# EAGLE design V-00716-02 (EAGLE 7.2.0)
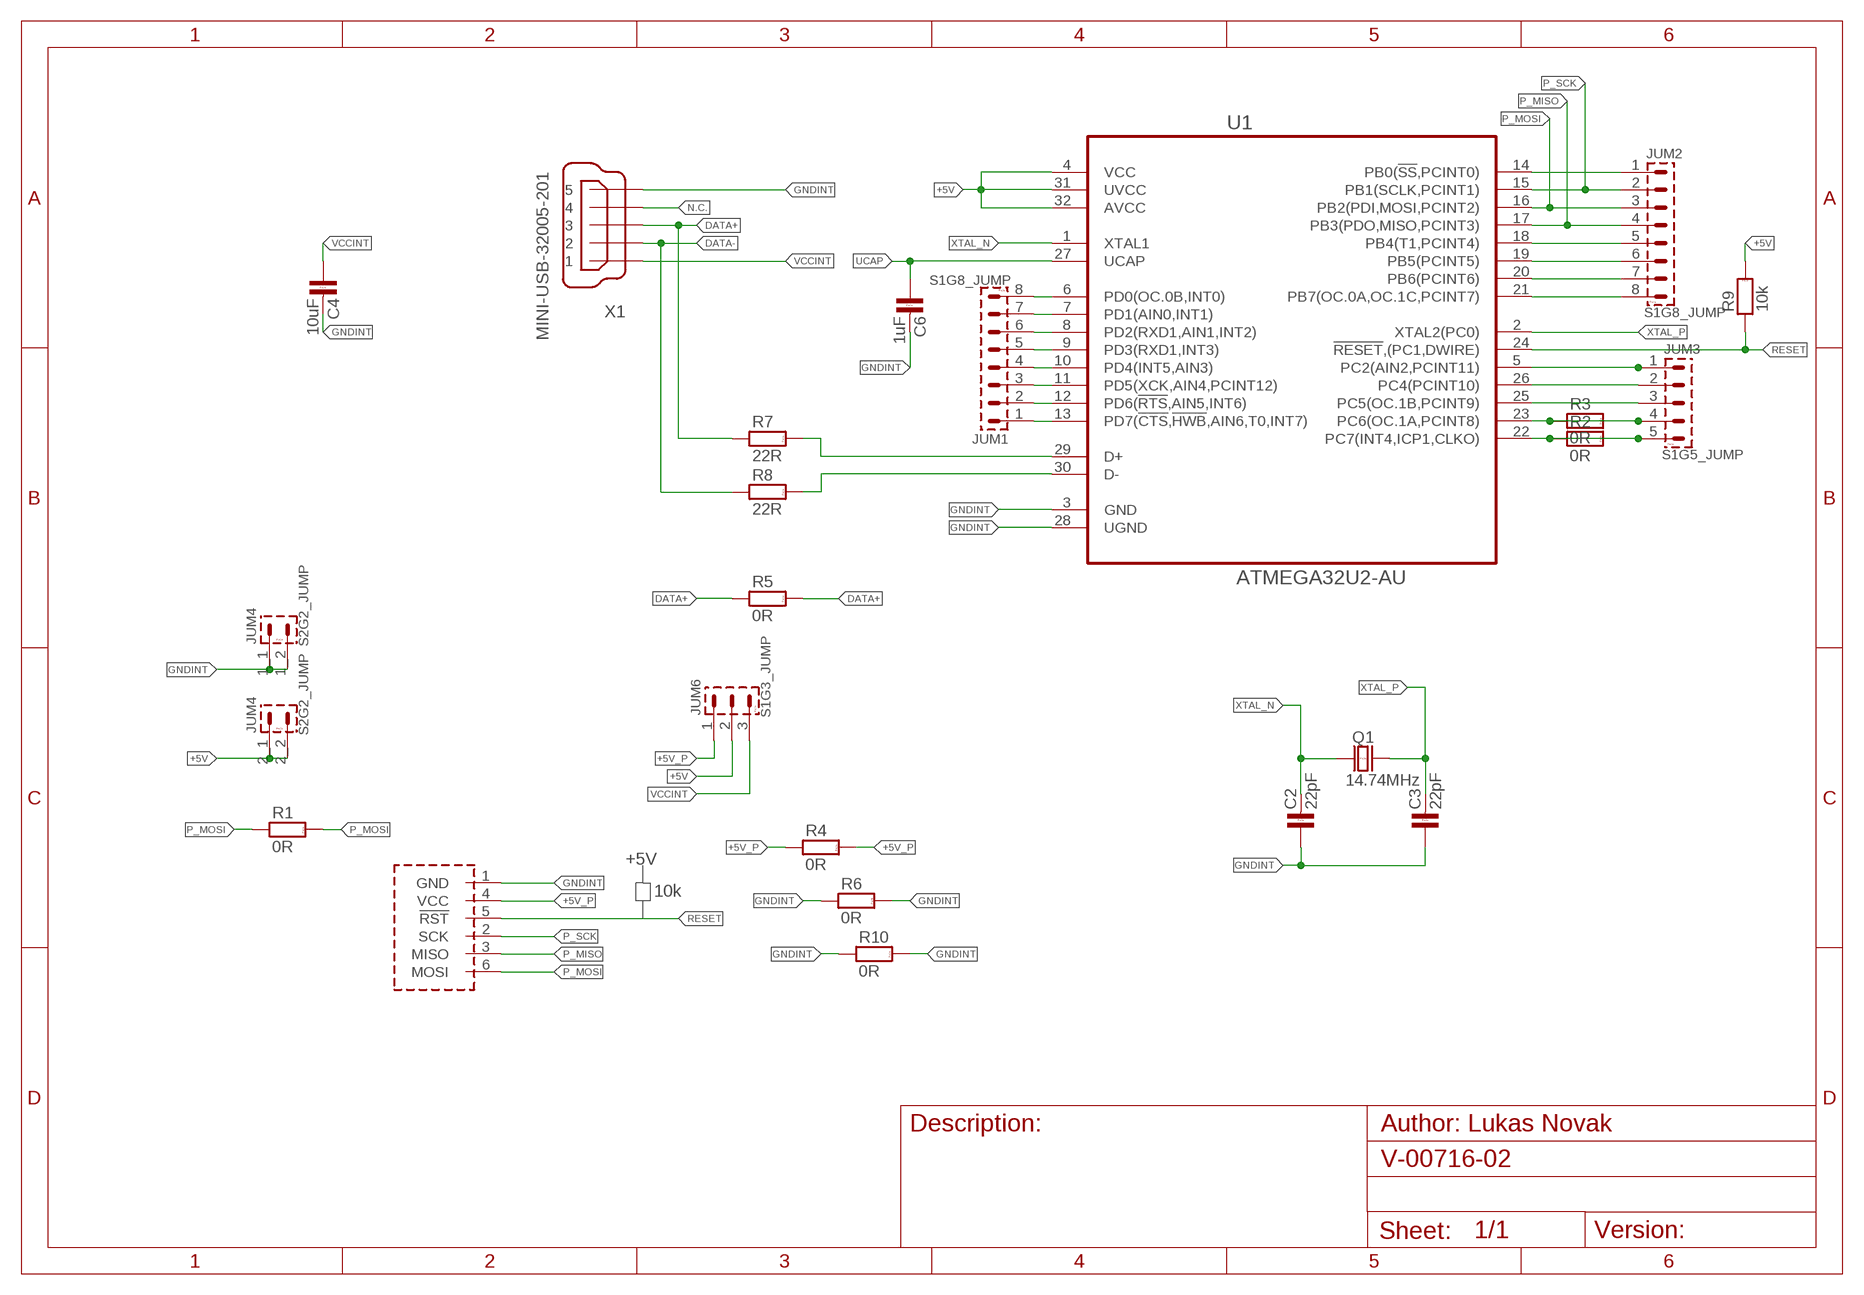
[diagram p0: schematic, sheet 1]

## Parts
C2  22pF  C-KER_0805  [0805]
C3  22pF  C-KER_0805  [0805]
C4  10uF  C-KER_1206  [1206]
C6  1uF  C-KER_1206  [1206]
JUM1  S1G8_JUMP  [S1G8_JUM]
JUM2  S1G8_JUMP  [S1G8_JUM]
JUM3  S1G5_JUMP  [S1G5_JUM]
JUM4  S2G2_JUMP  [S2G2_JUM]
JUM6  S1G3_JUMP  [S1G3_JUM]
Q1  14.74MHz  Q_HC-49U  [HC-49U]
R1  0R  R_1206  [1206]
R2  0R  R_1206  [1206]
R3  0R  R_1206  [1206]
R4  0R  R_1206  [1206]
R5  0R  R_1206  [1206]
R6  0R  R_1206  [1206]
R7  22R  R_1206  [1206]
R8  22R  R_1206  [1206]
R9  10k  R_1206  [1206]
R10  0R  R_1206  [1206]
U1  ATMEGA32U2-AU  [QFP80P900X900X120-32N]
U$1  AVR_PROG_SPI  [PSH02-06P]
X1  MINI-USB-32005-201  [32005-201]

## Nets
+5V: JUM4.2_1 JUM4.2_2 JUM6.2 R9.2 U1.4(VCC) U1.31(UVCC) U1.32(AVCC)
+5V_P: JUM6.1 R4.1 R4.2 U$1.4(VCC)
DATA+: R5.1 R5.2 R7.1 X1.3
DATA-: R8.1 X1.2
GNDINT: C2.1 C3.1 C4.2 C6.2 JUM4.1_1 JUM4.1_2 R6.1 R6.2 R10.1 R10.2 U1.3(GND) U1.28(UGND) U$1.1(GND) X1.5
N$1: JUM1.1 U1.13(PD7(!CTS,!HWB,AIN6,T0,INT7))
N$2: R7.2 U1.29(D+)
N$3: JUM1.2 U1.12(PD6(!RTS,AIN5,INT6))
N$4: JUM1.3 U1.11(PD5(XCK,AIN4,PCINT12))
N$5: JUM1.4 U1.10(PD4(INT5,AIN3))
N$6: JUM1.5 U1.9(PD3(RXD1,INT3))
N$7: JUM1.6 U1.8(PD2(RXD1,AIN1,INT2))
N$8: JUM1.7 U1.7(PD1(AIN0,INT1))
N$9: JUM1.8 U1.6(PD0(OC.0B,INT0))
N$10: JUM3.1 U1.5(PC2(AIN2,PCINT11))
N$11: JUM3.2 U1.26(PC4(PCINT10))
N$12: R8.2 U1.30(D-)
N$13: JUM3.3 U1.25(PC5(OC.1B,PCINT9))
N$14: JUM3.4 R3.1 R3.2 U1.23(PC6(OC.1A,PCINT8))
N$15: JUM3.5 R2.1 R2.2 U1.22(PC7(INT4,ICP1,CLKO))
N$16: JUM2.1 U1.14(PB0(!SS,PCINT0))
N$20: JUM2.5 U1.18(PB4(T1,PCINT4))
N$21: JUM2.6 U1.19(PB5(PCINT5))
N$22: JUM2.7 U1.20(PB6(PCINT6))
N$23: JUM2.8 U1.21(PB7(OC.0A,OC.1C,PCINT7))
N.C.: X1.4
P_MISO: JUM2.4 U1.17(PB3(PDO,MISO,PCINT3)) U$1.3(MISO)
P_MOSI: JUM2.3 R1.1 R1.2 U1.16(PB2(PDI,MOSI,PCINT2)) U$1.6(MOSI)
P_SCK: JUM2.2 U1.15(PB1(SCLK,PCINT1)) U$1.2(SCK)
RESET: R9.1 U1.24(!RESET,(PC1,DWIRE)) U$1.5(!RST)
UCAP: C6.1 U1.27(UCAP)
VCCINT: C4.1 JUM6.3 X1.1
XTAL_N: C2.2 Q1.1 U1.1(XTAL1)
XTAL_P: C3.2 Q1.2 U1.2(XTAL2(PC0))

## Notes on the sheet
- +5V
- 10k

## Library data of the parts
C2-C4 C6 = #PaJa_31:C-KER: Kondenzator - keramicky
JUM1 JUM2 = #PaJa_konektory:S1G8_JUMP: Radove konektory - koliky - 8x
JUM3 = #PaJa_konektory:S1G5_JUMP: Radove konektory - koliky - 5x
JUM4 = #PaJa_konektory:S2G2_JUMP: Radove konektory - koliky - dvojite - 2x2
JUM6 = #PaJa_konektory:S1G3_JUMP: Radove konektory - koliky - 3x
Q1 = #PaJa_31:Q: Krystal HC-49 - 1MHz - 48MHz DT38 - Quartz (hodinovy) 32,768kHz
R1-R10 = #PaJa_31:R: Rezistor
U1 = #_Atmel_By_element14_Batch_1-00:ATMEGA32U2-AU: 8-bit Microcontroller with ISP Flash and USB Controller; MPN: ATMEGA32U2-AU; OC_FARNELL: 1748524; OC_NEWARK: 26R5632; PACKAGE: TQFP-32; SUPPLIER: Atmel
U$1 = #PaJa_konektory:AVR_PROG_SPI
X1 = con-cypressindustries:MINI-USB-: MINI USB-B Conector Source: www.cypressindustries.com; OC_FARNELL: unknown; OC_NEWARK: unknown

## Net classes
0 default: width 0.406 mm, clearance 0.406 mm

## Board
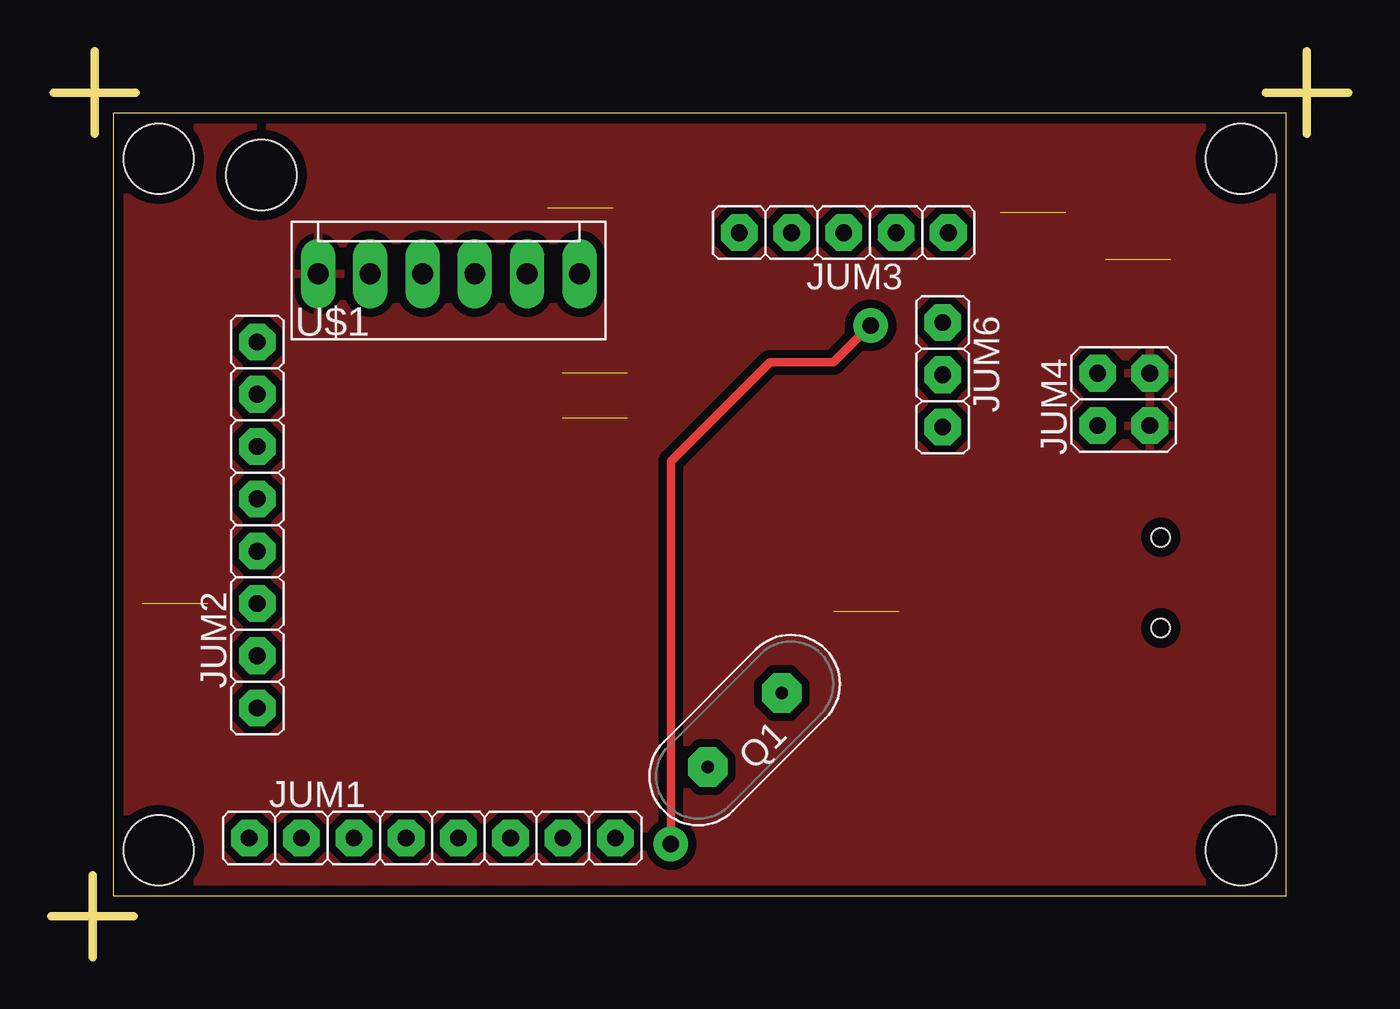
[diagram p1: board, top side]
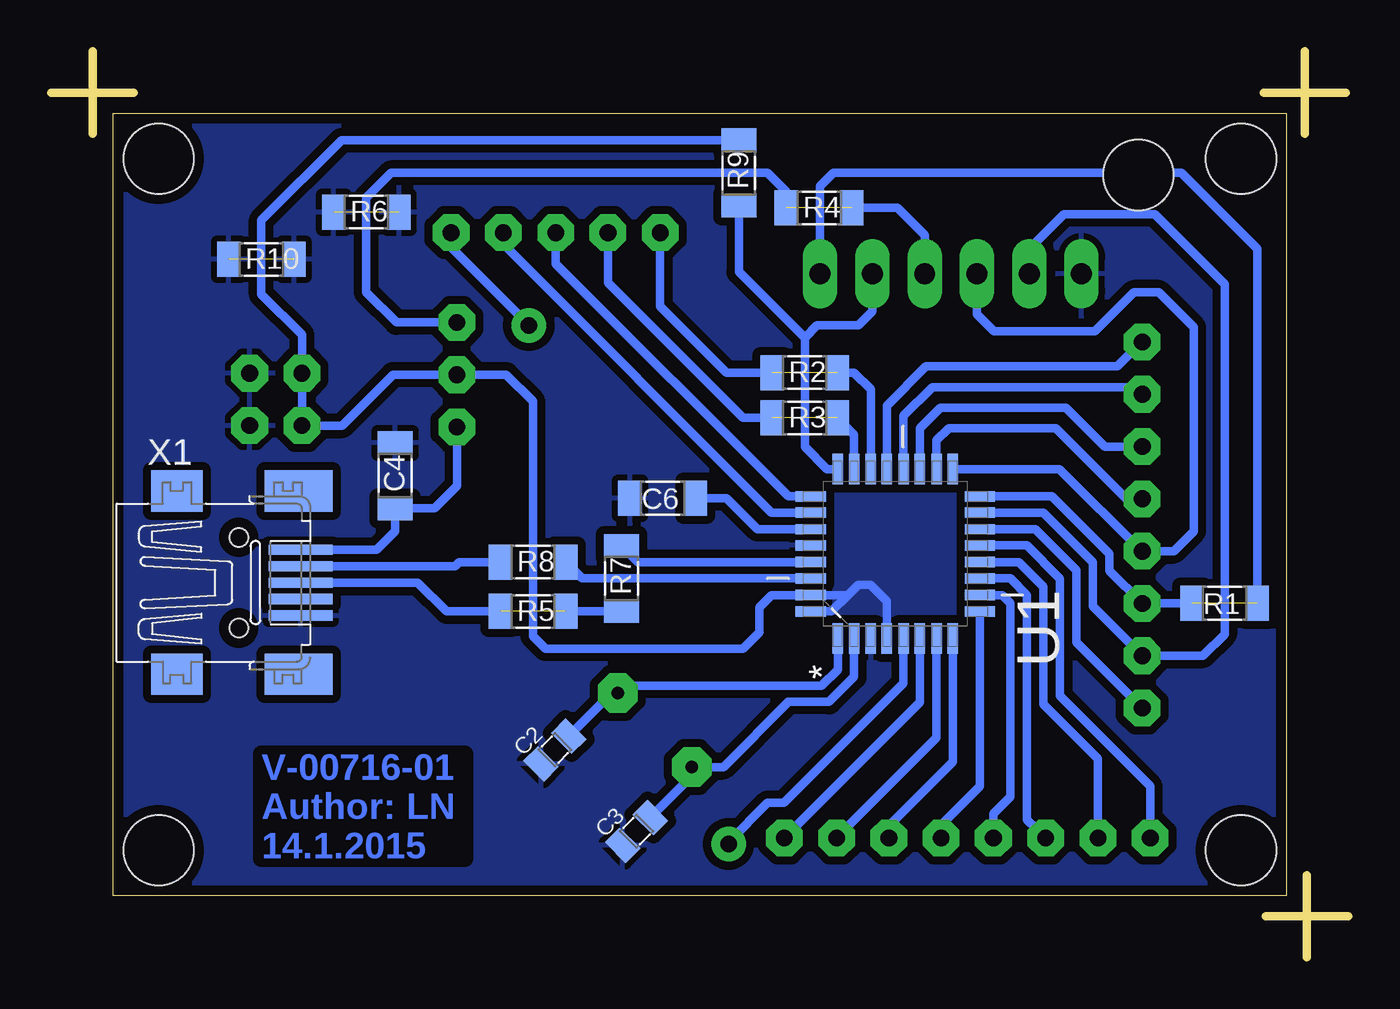
[diagram p2: board, bottom side, seen from below]

Size 63 x 44 mm. Coordinates in mm from the lower left corner, seen from the top.
Outline: 4,2 2,2
Outline: 2,2 0,2
Outline: 2,2 2,4
Outline: 2,2 2,0
Outline: 2.1,42 2.1,40
Outline: 2.1,42 4.1,42
Outline: 2.1,42 0.1,42
Outline: 2.1,42 2.1,44
Outline: 61,42 61,40
Outline: 61,42 59,42
Outline: 61,42 63,42
Outline: 61,42 61,44
Outline: 3,3 60,3 60,41 3,41 3,3
Copper layers (1*16): Top 0.035mm / dielectric 1.5mm / Bottom 0.035mm
Design rules "mucha_navrh *": minimum track width 0.2mm, minimum drill 0.3mm, track to track 0.2mm, track to pad 0.2mm, pad to pad 0.2mm, via to via 0.2mm, smd to smd 0mil, copper to edge 0.5mm, drill to drill 0.5mm, minimum pad ring 0.3mm, minimum via ring 0.3mm, stop-mask expansion 0.1mm, vias tented up to drill 0.5mm, thermal gap 0.3mm
Holes 3.4 mm at 5.2,38.8 57.8,5.2 57.8,38.8 5.2,5.2 10.2,38

### Footprints (pad centres in the part's own frame; a part is rotated, then mirrored left to right if it is on the bottom)
0805 = smd 1.016 x 1.422: 1 -0.953,0; 2 0.953,0
1206 = smd 1.143 x 1.702: 1 -1.587,0; 2 1.587,0
S1G8_JUM = drill 0.813 pad 1.778 octagon: 1 -8.89,0; 2 -6.35,0; 3 -3.81,0; 4 -1.27,0; 5 1.27,0; 6 3.81,0; 7 6.35,0; 8 8.89,0
S1G5_JUM = drill 0.813 pad 1.778 octagon: 1 -5.08,0; 2 -2.54,0; 3 0,0; 4 2.54,0; 5 5.08,0
S2G2_JUM = drill 0.813 pad 1.778 octagon: 1_1 -1.27,-1.27; 1_2 1.27,-1.27; 2_1 -1.27,1.27; 2_2 1.27,1.27
S1G3_JUM = drill 0.813 pad 1.778 octagon: 1 -2.54,0; 2 0,0; 3 2.54,0
HC-49U = drill 0.61 pad 1.93 octagon: 1 -2.54,0; 2 2.54,0
QFP80P900X900X120-32N = smd 1.473 x 0.508: 1 -4.115,2.794; 2 -4.115,2.007; 3 -4.115,1.194; 4 -4.115,0.406; 5 -4.115,-0.406; 6 -4.115,-1.194; 7 -4.115,-2.007; 8 -4.115,-2.794; 17 4.115,-2.794; 18 4.115,-2.007; 19 4.115,-1.194; 20 4.115,-0.406; 21 4.115,0.406; 22 4.115,1.194; 23 4.115,2.007; 24 4.115,2.794 | smd 0.508 x 1.473: 9 -2.794,-4.115; 10 -2.007,-4.115; 11 -1.194,-4.115; 12 -0.406,-4.115; 13 0.406,-4.115; 14 1.194,-4.115; 15 2.007,-4.115; 16 2.794,-4.115; 25 2.794,4.115; 26 2.007,4.115; 27 1.194,4.115; 28 0.406,4.115; 29 -0.406,4.115; 30 -1.194,4.115; 31 -2.007,4.115; 32 -2.794,4.115
PSH02-06P = drill 1.016 pad 1.422 long: 1 -6.35,0; 2 -3.81,0; 3 -1.27,0; 4 1.27,0; 5 3.81,0; 6 6.35,0
32005-201 = smd 3.1 x 0.5: 1 3,1.6; 2 3,0.8; 3 3,0; 4 3,-0.8; 5 3,-1.6 | smd 2.5 x 2: M1 -3,-4.45; M2 -3,4.45 | smd 3.3 x 2: M3 2.9,4.45; M4 2.9,-4.45 | hole 0.9: 0,2.2; 0,-2.2

### Placement (x,y rotation side)
C2  38.54,10.08 45 bottom
C3  34.58,6.12 45 bottom
C4  46.3,23.4 90 bottom
C6  33.3,22.3 180 bottom
JUM1  18.5,5.8 0 top
JUM2  10,21 90 top
JUM3  38.5,35.2 180 top
JUM4  52.1,27.1 90 top
JUM6  43.3,28.3 270 top
Q1  33.68,11.04 225 top
R1  6,17.2 180 bottom
R2  26.4,28.4 0 bottom
R3  26.4,26.2 0 bottom
R4  25.7,36.4 0 bottom
R5  39.6,16.8 0 bottom
R6  47.7,36.2 0 bottom
R7  35.3,18.4 90 bottom
R8  39.6,19.2 0 bottom
R9  29.6,38.1 90 bottom
R10  52.8,33.9 0 bottom
U1  22,19.6 90 bottom
U$1  19.3,33.2 0 top
X1  53.9,18.2 0 bottom

### Tracks (layer width: path | path; a pad name or v marks a point on that pad's centre or on a via)
+5V
  Bottom 0.406: 24.31,17.59 U1.31 28.01,17.59 28.6,17 28.6,15.8 29.4,15 39,15 39.6,15.6 39.6,27 40.9,28.3 JUM6.2 46.4,28.3 48.87,25.83 JUM4.2_1 JUM4.2_2 50.83,30.23 52.8,32.2 52.8,35.8 48.91,39.69 R9.2 | U1.32 25.09,16.81 24.31,17.59 | U1.4 22.41,17.31 23.2,18.1 23.8,18.1 24.31,17.59
  pour Bottom (rank 4): 19,22.6 25,22.6 25,16.6 19.1,16.6
+5V_P  (1 unrouted)
  Bottom 0.406: U$1.4 20.57,35.07 21.9,36.4 R4.2 | JUM6.1 46.24,30.84 47.7,32.3 47.7,36.9 46.5,38.1 28.2,38.1 27.29,37.19 R4.1
DATA+  (1 unrouted)
  Bottom 0.406: X1.3 45.2,18.2 43.8,16.8 R5.1 | R5.2 35.31,16.8 R7.1
DATA-
  Bottom 0.406: X1.2 43.4,19 43.2,19.2 R8.1
GNDINT  (2 unrouted)
  pour Top (isolate 0.406, rank 6): 3,3 60,3 60,41 3,41
  pour Bottom (isolate 0.254, rank 6): 3,3 60,3 60,41 3,41
N$1
  Bottom 0.406: U1.13 15.61,20.01 14,18.4 14,12.7 9.61,8.31 JUM1.1
N$2
  Bottom 0.406: U1.29 34.51,19.19 R7.2
N$3
  Bottom 0.406: U1.12 15.99,19.19 14.8,18 14.8,12.3 12.15,9.65 JUM1.2
N$4
  Bottom 0.406: U1.11 16.41,18.41 15.6,17.6 15.6,6.69 JUM1.3
N$5
  Bottom 0.406: U1.10 16.79,17.59 16.4,17.2 16.4,7.8 17.23,6.97 JUM1.4
N$6
  Bottom 0.406: U1.9 17.88,8.32 17.9,8.3 18.05,8.15 19.77,6.43 JUM1.5
N$7
  Bottom 0.406: U1.8 19.21,9.49 22.31,6.39 JUM1.6
N$8
  Bottom 0.406: U1.7 19.99,10.66 JUM1.7
N$9
  Bottom 0.406: U1.6 20.81,12.38 JUM1.8
N$10  (via drill 0.8 pad 1.68)
  Top 0.406: v39.8,30.7 38,28.9 34.9,28.9 30.1,24.1 v30.1,5.5
  Bottom 0.406: 43.88,35.5 JUM3.1 43.58,34.48 v39.8,30.7 | v30.1,5.5 30.1,5.6 28.2,7.5 27.4,7.5 21.59,13.31 U1.5
N$11
  Bottom 0.406: U1.26 28.01,21.61 41.04,34.64 JUM3.2
N$12
  Bottom 0.406: U1.30 37.22,18.41 R8.2
N$13
  Bottom 0.406: U1.25 27.19,22.39 38.5,33.7 JUM3.3
N$14  (1 unrouted)
  Bottom 0.406: U1.23 24.01,25.39 R3.2 | JUM3.4 35.96,32.76 29.4,26.2 R3.1
N$15  (1 unrouted)
  Bottom 0.406: U1.22 23.19,27.59 24,28.4 R2.2 | JUM3.5 33.42,31.62 30.2,28.4 R2.1
N$16
  Bottom 0.406: U1.14 15.19,20.79 13.2,18.8 13.2,15.31 JUM2.1
N$20
  Bottom 0.406: U1.18 19.99,25.11 19.4,25.7 14.2,25.7 10.77,22.27 JUM2.5
N$21
  Bottom 0.406: U1.19 20.81,25.69 19.8,26.7 13.7,26.7 11.81,24.81 JUM2.6
N$22
  Bottom 0.406: U1.20 21.59,26.31 20.2,27.7 10.35,27.7 JUM2.7
N$23
  Bottom 0.406: U1.21 22.41,26.79 20.5,28.7 11.2,28.7 JUM2.8
P_MISO
  Bottom 0.406: U1.17 14.02,23.71 10.03,19.73 JUM2.4 8.47,19.73 7.5,20.7 7.5,30.6 9.2,32.3 10.4,32.3 12.3,30.4 17.2,30.4 18.03,31.23 U$1.3
P_MOSI  (1 unrouted)
  Bottom 0.406: U1.16 14.39,22.39 11.6,19.6 11.6,18.79 JUM2.3 R1.2 | U$1.6 25.65,37.45 25,38.1 8.1,38.1 4.41,34.41 R1.1
P_SCK
  Bottom 0.406: U$1.2 15.49,34.41 13.8,36.1 9.4,36.1 6,32.7 6,15.7 7.05,14.65 JUM2.2 12.4,17.05 12.4,19.2 14.81,21.61 U1.15
RESET
  Bottom 0.406: U$1.5 23.11,31.39 23.8,30.7 25.8,30.7 26.4,30.1 | 26.4,30.1 26.4,24.8 25.32,23.71 U1.24 | R9.1 29.6,33.3 26.4,30.1
UCAP
  Bottom 0.406: U1.27 28.69,20.79 30.2,22.3 C6.1
VCCINT
  Bottom 0.406: X1.1 47.2,19.8 46.3,20.7 C4.1 44.39,21.81 43.3,22.9 JUM6.3
XTAL_N
  Bottom 0.406: U1.1 24.79,13.98 25.59,13.19 35.13,13.19 Q1.1 35.78,12.84 C2.2
XTAL_P
  Bottom 0.406: U1.2 24.01,13.62 25.21,12.41 27.21,12.41 27.21,12.39 30.36,9.25 Q1.2 31.89,8.81 33.4,7.3 33.4,7.29 C3.2

### Text on the board
Bottom: V-00716-01 / Author: LN / 14.1.2015